# Altium schematic sheet Block Diagram.SchDoc
size A4; ENG_APP_DATE: --/--/--; DSN_APP_DATE: --/--/--; CHK_APP_DATE: --/--/--; Engineer: Mustafa Oguz ATES; DocumentNumber: 2; SheetNumber: 2; SheetTotal: 5
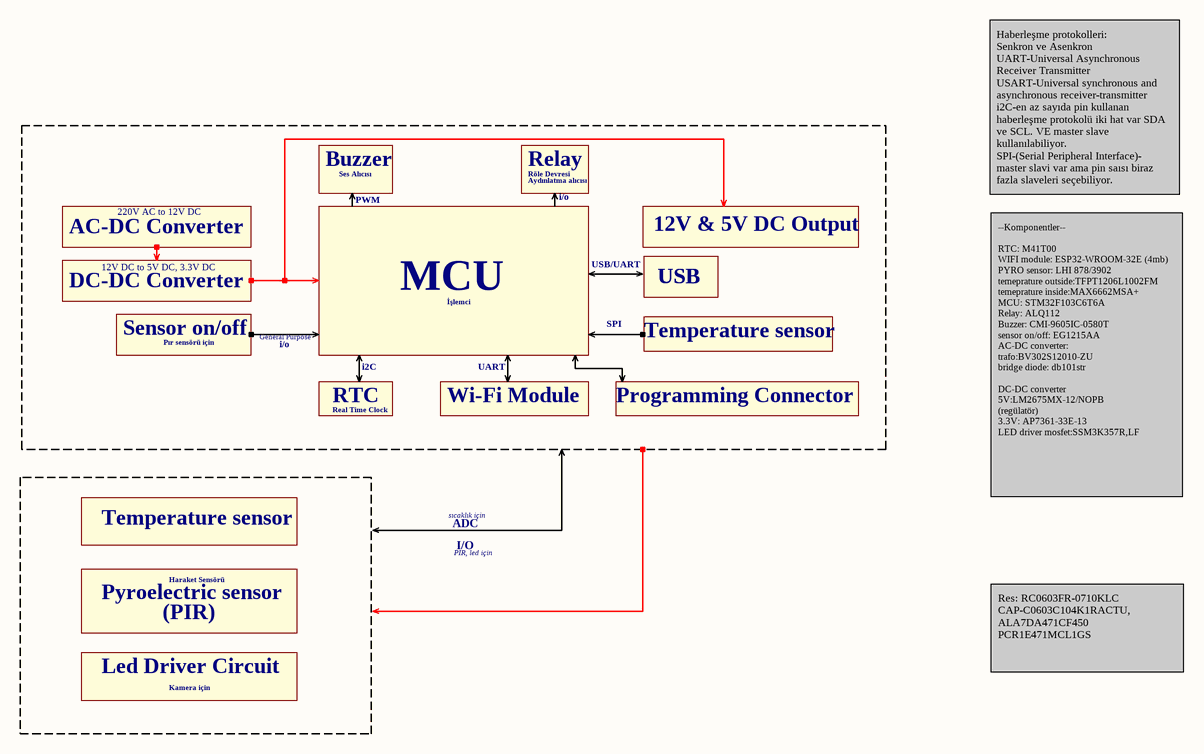
[diagram p0: Block Diagram.SchDoc]

## Notes on the sheet
- 220V AC to 12V DC
- Buzzer
- Ses Alıcısı
- PWM
- Relay
- Aydınlatma alıcısı
- Röle Devresi
- i/o
- Haberleşme protokolleri:
  Senkron ve Asenkron
  UART-Universal Asynchronous Receiver Transmitter
  USART-Universal synchronous and asynchronous receiver-transmitter
  i2C-en az sayıda pin kullanan haberleşme protokolü iki hat var SDA ve SCL. VE master slave kullanılabiliyor.
  SPI-(Serial Peripheral Interface)- master slavi var ama pin saısı biraz fazla slaveleri seçebiliyor.
- AC-DC Converter
- 12V DC to 5V DC, 3.3V DC
- 1 0 da olur ama pwm ile süürerek melodili ses üretiriz.
- USB/UART
- 12V & 5V DC Output
- DC-DC Converter
- Sensor on/off
- Pır sensörü için
- General Purpose
- MCU
- İşlemci
- SPI
- Temperature sensor
- USB
- 1 ve 0 lar için.
- RTC
- Real Time Clock
- i2C
- Wi-Fi Module
- UART
- Programming Connector
- sıcaklık için
- ADC
- I/O
- --Komponentler--
  RTC: M41T00
  WIFI module: ESP32-WROOM-32E (4mb)
  PYRO sensor: LHI 878/3902
  temeprature outside:TFPT1206L1002FM
  temeprature inside:MAX6662MSA+
  MCU: STM32F103C6T6A
  Relay: ALQ112
  Buzzer: CMI-9605IC-0580T
  sensor on/off: EG1215AA
  AC-DC converter:
  trafo:BV302S12010-ZU
  bridge diode: db101str
  DC-DC converter
  5V:LM2675MX-12/NOPB
  (regülatör)
  3.3V: AP7361-33E-13
  LED driver mosfet:SSM3K357R,LF
- Pyroelectric sensor
- Haraket Sensörü
- ADC-(Analog-to-digital converter) analog giriş voltajı değerini okuyabilen ve dijital değere dönüştürebilen bir cihazdır.
- PIR, led için
- Komponent tedarik siteleri:
  Digikey
  Mouser
  farnell
  RS component
  LSCS
- Led Driver Circuit
- (PIR)
- Res: RC0603FR-0710KLC
  CAP-C0603C104K1RACTU,
  ALA7DA471CF450
  PCR1E471MCL1GS
- Kamera için
- Engineer: